# EAGLE design NokiaPic (EAGLE 5.06)
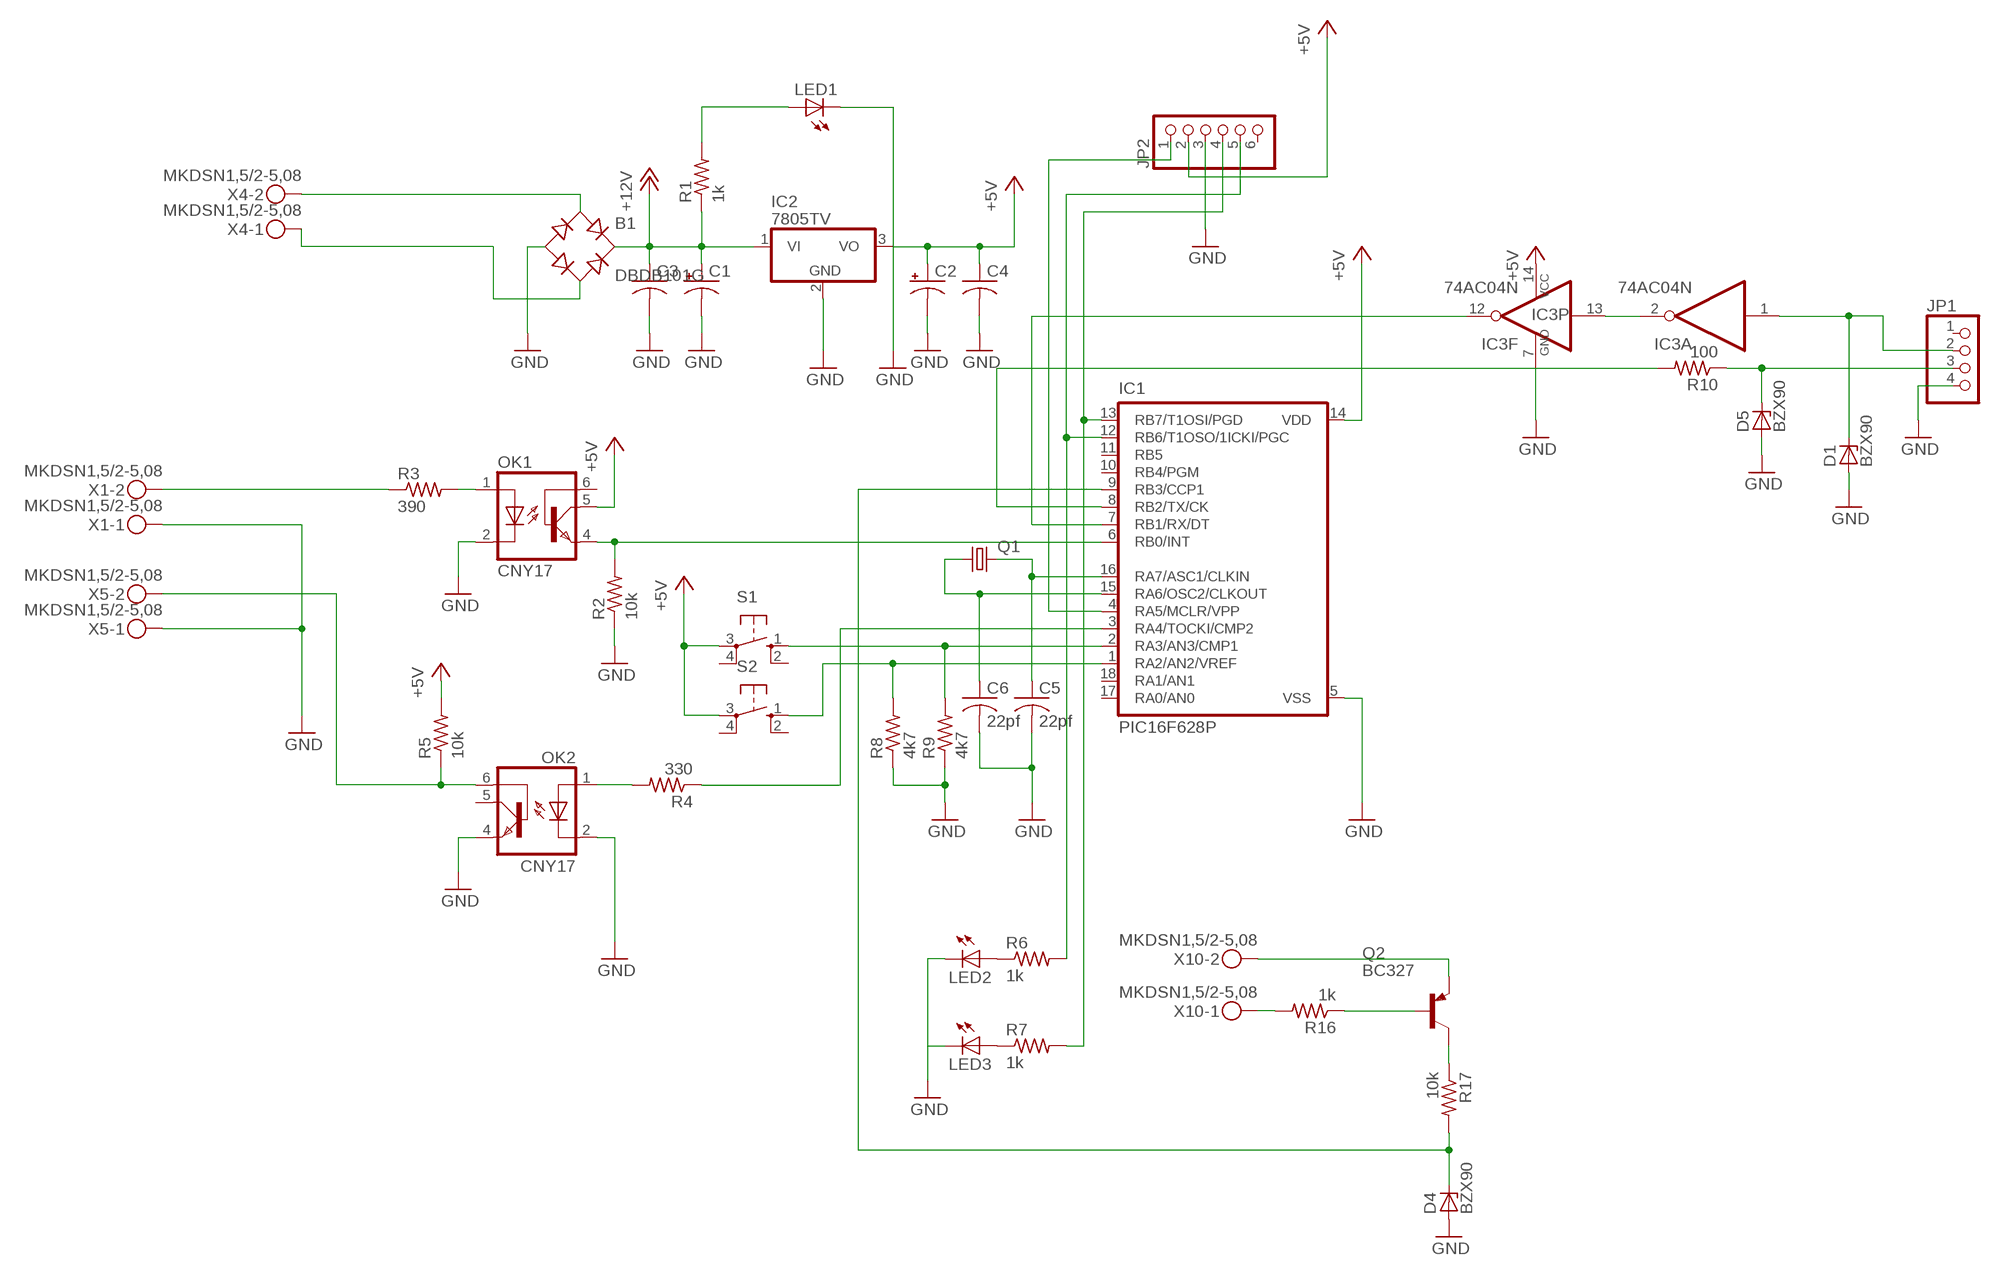
[diagram p0: schematic, sheet 1]

## Parts
B1  DBDB101G  [DB]
C1  CPOL-USE5-8.5  [E5-8,5]
C2  CPOL-USE5-4  [E5-4]
C3  C-US025-025X050  [C025-025X050]
C4  C-US025-025X050  [C025-025X050]
C5  22pf  C-USC1206K  [C1206K]
C6  22pf  C-USC1206K  [C1206K]
D1  BZX90  [DO34Z7]
D4  BZX90  [DO34Z7]
D5  BZX90  [DO34Z7]
IC1  PIC16F628P  [DIL18]
IC2  7805TV  [TO220V]
IC3  74AC04N  [DIL14]
JP1  PINHD-1X4  [1X04]
JP2  PINHD-1X6  [1X06]
LED1  LED3MM  [LED3MM]
LED2  LED3MM  [LED3MM]
LED3  LED3MM  [LED3MM]
OK1  CNY17  [DIL06]
OK2  CNY17  [DIL06]
Q1  CRYSTALHC49S  [HC49/S]
Q2  BC327  [TO92-EBC]
R1  1k  R-US_M1206  [M1206]
R2  10k  R-US_M1206  [M1206]
R3  390  R-US_M1206  [M1206]
R4  330  R-US_M1206  [M1206]
R5  10k  R-US_M1206  [M1206]
R6  1k  R-US_M1206  [M1206]
R7  1k  R-US_M1206  [M1206]
R8  4k7  R-US_M1206  [M1206]
R9  4k7  R-US_M1206  [M1206]
R10  100  R-US_M1206  [M1206]
R16  1k  R-US_M1206  [M1206]
R17  10k  R-US_M1206  [M1206]
S1  10-XX  [B3F-10XX]
S2  10-XX  [B3F-10XX]
X1  MKDSN1,5/2-5,08  [MKDSN1,5/2-5,08]
X4  MKDSN1,5/2-5,08  [MKDSN1,5/2-5,08]
X5  MKDSN1,5/2-5,08  [MKDSN1,5/2-5,08]
X10  MKDSN1,5/2-5,08  [MKDSN1,5/2-5,08]

## Nets
+5V: C2.+ C4.1 IC1.14(VDD) IC2.3(VO) IC3.14(P:VCC) JP2.2 OK1.5(COL) R5.2 S1.3(P) S2.3(P)
+12V: B1.+ C1.+ C3.1 IC2.1(VI) R1.1
GND: B1.- C1.- C2.- C3.2 C4.2 C5.2 C6.2 D1.A D4.A D5.A IC1.5(VSS) IC2.2(GND) IC3.7(P:GND) JP1.4 JP2.3 LED1.K(C) LED2.K(C) LED3.K(C) OK1.2(C) OK2.2(C) OK2.4(EMI) R2.1 R8.1 R9.1 X1.1 X5.1
N$1: OK2.1(A) R4.2
N$2: B1.AC2 X4.1
N$3: B1.AC1 X4.2
N$4: IC1.3(RA4/TOCKI/CMP2) R4.1
N$5: IC1.4(RA5/MCLR/VPP) JP2.1
N$6: LED3.A R7.1
N$7: LED1.A R1.2
N$8: OK1.1(A) R3.2
N$9: IC1.13(RB7/T1OSI/PGD) JP2.4 R7.2
N$10: IC1.6(RB0/INT) OK1.4(EMI) R2.2
N$11: IC1.12(RB6/T1OSO/1ICKI/PGC) JP2.5 R6.2
N$14: OK2.6(BAS) R5.1 X5.2
N$15: R3.1 X1.2
N$16: LED2.A R6.1
N$17: IC3.2(A:O) IC3.13(F:I)
N$18: D1.C IC3.1(A:I) JP1.2
N$19: C5.1 IC1.16(RA7/ASC1/CLKIN) Q1.2
N$20: IC1.1(RA2/AN2/VREF) R8.2 S2.1(S)
N$21: IC1.2(RA3/AN3/CMP1) R9.2 S1.1(S)
N$22: C6.1 IC1.15(RA6/OSC2/CLKOUT) Q1.1
N$23: IC1.8(RB2/TX/CK) R10.2
N$24: D5.C JP1.3 R10.1
N$25: IC1.7(RB1/RX/DT) IC3.12(F:O)
N$44: Q2.E X10.2
N$45: Q2.B R16.1
N$46: Q2.C R17.1
N$47: R16.2 X10.1
N$48: D4.C IC1.9(RB3/CCP1) R17.2
Unconnected: IC1.10(RB4/PGM) IC1.11(RB5) IC1.17(RA0/AN0) IC1.18(RA1/AN1) IC3.3(B:I) IC3.4(B:O) IC3.5(C:I) IC3.6(C:O) IC3.8(D:O) IC3.9(D:I) IC3.10(E:O) IC3.11(E:I) JP1.1 JP2.6 OK1.6(BAS) OK2.5(COL) S1.2(S1) S1.4(P1) S2.2(S1) S2.4(P1)

## Library data of the parts
B1 = rectifier:DB?*G: Single Phase 1.0 AMP Glass Passivated Bridge Rectifier Taiwan Semiconductor Co.,Ltd. - TSC Source: http://www.taiwansemi.com/TSCbig5/ezcatfiles/cust/img/img/db101g.pdf http://www.ts.com.tw/db/pictures/modules/PDT/PDT060207001/DBLS201G.pdf
C1 C2 = rcl:CPOL-US: POLARIZED CAPACITOR, American symbol
C3-C6 = rcl:C-US: CAPACITOR, American symbol
D1 D4 D5 = diode:BZX90: Z DIODE
IC1 = microchip:PIC16*F62: FLASH-Based 8-Bit CMOS Microcontroller Source: http://ww1.microchip.com/downloads/en/DeviceDoc/40300C.pdf
IC2 = linear:78*: Positive VOLTAGE REGULATOR Source: http://cache.national.com/ds/LM/LM78L05.pdf http://www.fairchildsemi.com/ds/LM/LM7805.pdf
IC3 = 74xx-eu:74*04: Hex INVERTER
JP1 = pinhead:PINHD-1X4: PIN HEADER
JP2 = pinhead:PINHD-1X6: PIN HEADER
LED1-LED3 = led:LED: LED OSRAM: - CHIPLED LG R971, LG N971, LY N971, LG Q971, LY Q971, LO R971, LY R971 LH N974, LH R974 LS Q976, LO Q976, LY Q976 LO Q996 - Hyper CHIPLED LW Q18S LB Q993, LB Q99A, LB R99A - SideLED LS A670, LO A670, LY A670, LG A670, LP A670 LB A673, LV A673, LT A673, LW A673 LH A674 LY A675 LS A676, LA A676, LO A676, LY A676, LW A676 LS A679, LY A679, LG A679 - Hyper Micro SIDELED® LS Y876, LA Y876, LO Y876, LY Y876 LT Y87S - SmartLED LW L88C, LW L88S LB L89C, LB L89S, LG L890 LS L89K, LO L89K, LY L89K LS L896, LA L896, LO L896, LY L896 - TOPLED LS T670, LO T670, LY T670, LG T670, LP T670 LSG T670, LSP T670, LSY T670, LOP T670, LYG T670 LG T671, LOG T671, LSG T671 LB T673, LV T673, LT T673, LW T673 LH T674 LS T676, LA T676, LO T676, LY T676, LB T676, LH T676, LSB T676, LW T676 LB T67C, LV T67C, LT T67C, LS T67K, LO T67K, LY T67K, LW E67C LS E67B, LA E67B, LO E67B, LY E67B, LB E67C, LV E67C, LT E67C LW T67C LS T679, LY T679, LG T679 LS T770, LO T770, LY T770, LG T770, LP T770 LB T773, LV T773, LT T773, LW T773 LH T774 LS E675, LA E675, LY E675, LS T675 LS T776, LA T776, LO T776, LY T776, LB T776 LHGB T686 LT T68C, LB T68C - Hyper Mini TOPLED® LB M676 - Mini TOPLED Santana® LG M470 LS M47K, LO M47K, LY M47K Source: http://www.osram.convergy.de LUXEON: - LUMILED® LXK2-PW12-R00, LXK2-PW12-S00, LXK2-PW14-U00, LXK2-PW14-V00 LXK2-PM12-R00, LXK2-PM12-S00, LXK2-PM14-U00 LXK2-PE12-Q00, LXK2-PE12-R00, LXK2-PE12-S00, LXK2-PE14-T00, LXK2-PE14-U00 LXK2-PB12-K00, LXK2-PB12-L00, LXK2-PB12-M00, LXK2-PB14-N00, LXK2-PB14-P00, LXK2-PB14-Q00 LXK2-PR12-L00, LXK2-PR12-M00, LXK2-PR14-Q00, LXK2-PR14-R00 LXK2-PD12-Q00, LXK2-PD12-R00, LXK2-PD12-S00 LXK2-PH12-R00, LXK2-PH12-S00 LXK2-PL12-P00, LXK2-PL12-Q00, LXK2-PL12-R00 Source: www.luxeon.com KINGBRIGHT: KA-3528ASYC Source: www.kingbright.com
OK1 OK2 = optocoupler:CNY17: SIEMENS OPTO COUPLER
Q1 = crystal:CRYSTAL: CRYSTAL
Q2 = transistor-pnp:BC327*: PNP Transistror
R1-R10 R16 R17 = rcl:R-US_: RESISTOR, American symbol
S1 S2 = switch-omron:10-XX: OMRON SWITCH
X1 X4 X5 X10 = con-phoenix-508:MKDSN1,5/2-5,08: MKDSN 1,5/ 2-5,08 Printklemme Nennstrom: 13,5 A Nennspannung: 250 V Rastermaß: 5,08 mm Polzahl: 2 Anschlussart: Schraubanschluss Montage: Löten Anschlussrichtung Leiter/Platine: 0 ° Artikelnummer: 1729128 Source: http://eshop.phoenixcontact.com .. 1729128.pdf

## Board
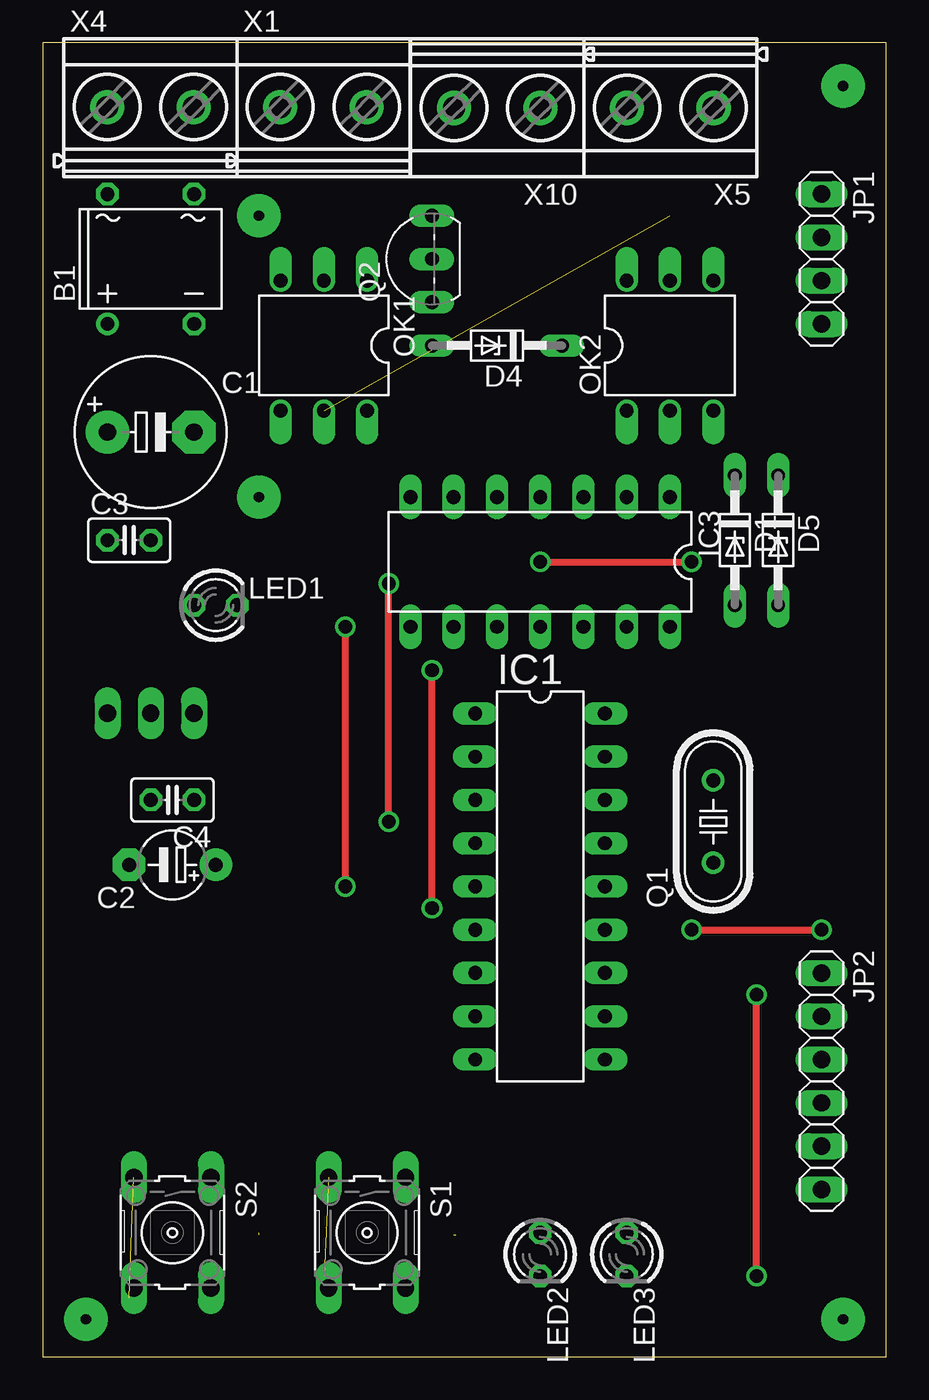
[diagram p1: board, top side]
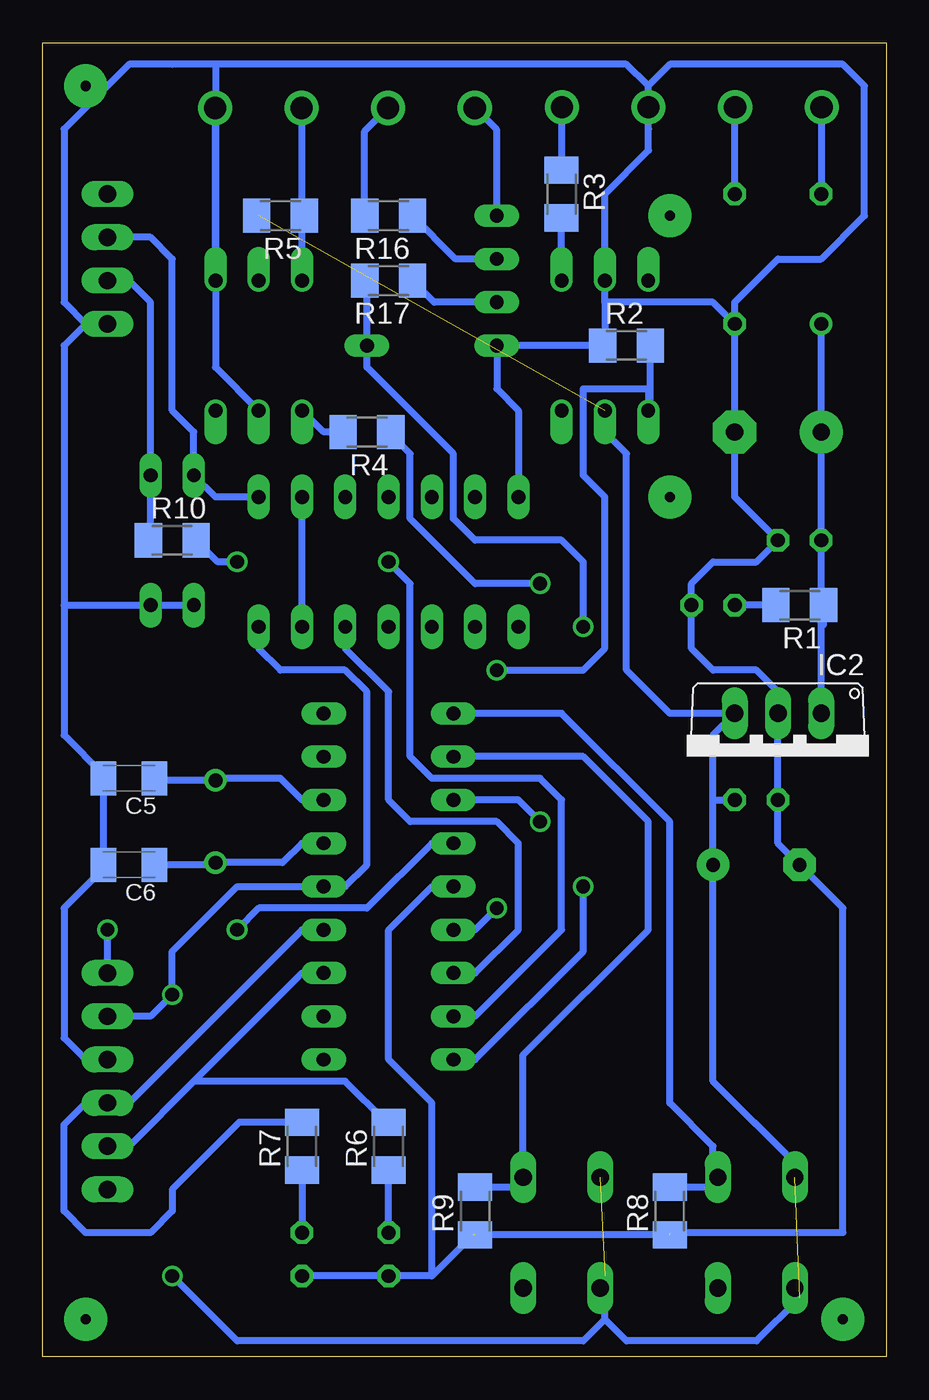
[diagram p2: board, bottom side, seen from below]

Size 49.52 x 77.14 mm. Coordinates in mm from the lower left corner, seen from the top.
Outline: 0,77.14 0,0 49.52,0 49.52,77.14 0,77.14
Copper layers (1*16): Top 0.035mm / dielectric 1.5mm / Bottom 0.035mm
Design rules "default": minimum track width 10mil, minimum drill 24mil, track to track 8mil, track to pad 8mil, pad to pad 8mil, via to via 8mil, smd to smd 8mil, copper to edge 40mil, drill to drill 8mil, minimum pad ring 10mil, minimum via ring 8mil, stop-mask expansion 4mil, vias tented up to drill 0mil, thermal gap 10mil

### Footprints (pad centres in the part's own frame; a part is rotated, then mirrored left to right if it is on the bottom)
DB = drill 0.813 round: + -2.54,-3.81 | drill 0.813 octagon: - 2.54,-3.81; AC1 2.54,3.81; AC2 -2.54,3.81
E5-8,5 = drill 1.016 pad 2.54 round: + -2.54,0 | drill 1.016 pad 2.54 octagon: - 2.54,0
E5-4 = drill 0.813 pad 1.905 round: + -2.54,0 | drill 0.813 pad 1.905 octagon: - 2.54,0
C025-025X050 = drill 0.813 octagon: 1 -1.27,0; 2 1.27,0
C1206K = smd 1.5 x 2: 1 -1.5,0; 2 1.5,0
DO34Z7 = drill 0.813 long: A 3.81,0; C -3.81,0
DIL18 = drill 0.813 long: 1 -10.16,-3.81; 2 -7.62,-3.81; 3 -5.08,-3.81; 4 -2.54,-3.81; 5 0,-3.81; 6 2.54,-3.81; 7 5.08,-3.81; 8 7.62,-3.81; 9 10.16,-3.81; 10 10.16,3.81; 11 7.62,3.81; 12 5.08,3.81; 13 2.54,3.81; 14 0,3.81; 15 -2.54,3.81; 16 -5.08,3.81; 17 -7.62,3.81; 18 -10.16,3.81
TO220V = drill 1.016 long: 1 -2.54,-2.54; 2 0,-2.54; 3 2.54,-2.54
DIL14 = drill 0.813 long: 1 -7.62,-3.81; 2 -5.08,-3.81; 3 -2.54,-3.81; 4 0,-3.81; 5 2.54,-3.81; 6 5.08,-3.81; 7 7.62,-3.81; 8 7.62,3.81; 9 5.08,3.81; 10 2.54,3.81; 11 0,3.81; 12 -2.54,3.81; 13 -5.08,3.81; 14 -7.62,3.81
1X04 = drill 1.016 long: 1 -3.81,0; 2 -1.27,0; 3 1.27,0; 4 3.81,0
1X06 = drill 1.016 long: 1 -6.35,0; 2 -3.81,0; 3 -1.27,0; 4 1.27,0; 5 3.81,0; 6 6.35,0
LED3MM = drill 0.813 octagon: A -1.27,0; K 1.27,0
DIL06 = drill 0.813 offset: 1 -2.54,-3.81; 2 0,-3.81; 3 2.54,-3.81; 4 2.54,3.81; 5 0,3.81; 6 -2.54,3.81
HC49/S = drill 0.813 round: 1 -2.413,0; 2 2.413,0
TO92-EBC = drill 0.813 long: B 0,-1.27; C -2.54,-1.27; E 2.54,-1.27
M1206 = smd 1.6 x 2: 1 -1.4,0; 2 1.4,0
B3F-10XX = drill 1.016 long: 1 -3.251,2.261; 2 3.251,2.261; 3 -3.251,-2.261; 4 3.251,-2.261
MKDSN1,5/2-5,08 = drill 1.3 pad 2 round: 1 -2.561,0.025; 2 2.519,0.025

### Placement (x,y rotation side)
B1  6.35,64.44 0 top
C1  6.35,54.28 0 top
C2  7.62,28.88 180 top
C3  5.08,47.93 0 top
C4  7.62,32.69 180 top
C5  44.45,33.96 180 bottom
C6  44.45,28.88 180 bottom
D1  40.64,47.93 270 top
D4  26.67,59.36 180 top
D5  43.18,47.93 270 top
IC1  29.21,27.61 270 top
IC2  6.35,35.23 180 bottom
IC3  29.21,46.66 180 top
JP1  45.72,64.44 270 top
JP2  45.72,16.18 270 top
LED1  10.16,44.12 0 top
LED2  29.21,6.02 270 top
LED3  34.29,6.02 270 top
OK1  16.51,59.36 180 top
OK2  36.83,59.36 0 top
Q1  39.37,31.42 90 top
Q2  21.59,64.44 90 top
R1  5.08,44.12 180 bottom
R2  15.24,59.36 0 bottom
R3  19.05,68.25 270 bottom
R4  30.48,54.28 180 bottom
R5  35.56,66.98 180 bottom
R6  29.21,12.37 90 bottom
R7  34.29,12.37 90 bottom
R8  12.7,8.56 90 bottom
R9  24.13,8.56 90 bottom
R10  41.91,47.93 0 bottom
R16  29.21,66.98 180 bottom
R17  29.21,63.17 180 bottom
S1  19.05,7.29 270 top
S2  7.62,7.29 270 top
X1  16.51,73.33 0 top
X4  6.35,73.33 0 top
X5  36.83,73.33 180 top
X10  26.67,73.33 180 top

### Tracks (layer width: path | path; a pad name or v marks a point on that pad's centre or on a via)
+5V  (via drill 0.8)  (3 unrouted)
  Top 0.406: v41.91,4.75 v41.91,21.26
  Bottom 0.406: 10.16,32.69 C4.1 | 10.16,32.69 C2.+ 10.16,16.18 | OK1.5 16.51,54.28 15.24,53.01 15.24,40.31 12.7,37.77 IC2.3 10.16,36.5 10.16,32.69 | IC3.14 36.83,41.58 35.56,40.31 31.75,40.31 30.48,39.04 30.48,28.88 31.75,27.61 IC1.14 38.1,27.61 41.91,23.8 v41.91,21.26 43.18,19.99 JP2.2 | R5.2 36.83,66.98 | S2.3 5.36,11.38 10.16,16.18 | 10.16,16.18 5.08,11.1 | 5.08,3.48 7.62,0.94 15.24,0.94 16.51,2.21 | 16.51,2.21 16.51,4.75 | 16.51,2.21 17.78,0.94 38.1,0.94 v41.91,4.75
+12V
  Bottom 0.406: B1.+ C1.+ C3.1 3.81,44.25 R1.1 | 3.68,43.52 3.81,44.66 | R1.1 3.68,43.52 | 3.68,43.52 3.68,42.98 | IC2.1 3.81,44.12 R1.1
GND  (2 unrouted)
  Bottom 0.406: 13.95,70.81 13.95,72.06 | 13.95,72.06 X1.1 | 13.95,70.81 16.51,68.25 OK1.2 16.51,61.9 | B1.- C1.- 8.89,50.47 C3.2 6.35,47.89 6.39,47.89 7.62,46.66 10.16,46.66 11.43,45.39 LED1.K 11.43,41.58 10.16,40.31 7.62,40.31 6.35,39.04 IC2.2 C4.2 6.35,30.15 C2.- 2.54,26.34 2.54,7.29 12.7,7.29 | JP2.3 46.99,17.45 48.26,18.72 48.26,26.34 45.95,28.65 C6.2 C5.2 45.95,34.19 48.26,36.5 48.26,44.12 | 39.37,75.87 15.24,75.87 13.97,74.6 13.97,72.08 13.95,72.06 | 39.37,75.87 41.91,75.87 | 13.95,70.81 13.95,74.62 12.7,75.87 2.54,75.87 1.27,74.6 1.27,66.98 3.81,64.44 6.35,64.44 8.89,61.9 B1.- | 16.51,61.9 16.51,59.49 R2.1 D4.A 22.86,56.82 21.59,55.55 IC3.7 | 16.51,61.9 10.16,61.9 B1.- | IC1.5 26.67,27.61 29.21,25.07 29.21,17.45 26.67,14.91 26.67,4.75 | OK2.4 39.37,73.28 X5.1 | 39.37,75.87 OK2.4 | 39.37,75.87 44.45,75.87 48.26,72.06 48.26,61.9 46.99,60.63 | 46.99,60.63 JP1.4 | 46.99,60.63 48.26,59.36 48.26,44.12 | D1.A D5.A 48.26,44.12 | OK2.4 39.37,58.09 OK2.2 | LED3.K LED2.K 26.67,4.75 | R8.1 24.26,7.16 26.67,4.75
N$1
  Bottom 0.406: 34.16,55.68 OK2.1 33.02,54.28 R4.2
N$2
  Bottom 0.406: X4.1 3.79,68.27 B1.AC2
N$3
  Bottom 0.406: X4.2 8.87,68.27 B1.AC1
N$4  (via drill 0.8)
  Top 0.406: v20.32,31.42 v20.32,45.39
  Bottom 0.406: R4.1 29.08,54.15 27.94,53.01 27.94,49.2 24.13,45.39 v20.32,45.39 | v20.32,31.42 21.59,32.69 IC1.3
N$5  (via drill 0.8)
  Top 0.406: v38.1,25.07 v45.72,25.07
  Bottom 0.406: IC1.4 26.67,30.15 30.48,26.34 36.83,26.34 v38.1,25.07 | v45.72,25.07 JP2.1
N$6
  Bottom 0.406: R7.1 LED3.A
N$7
  Bottom 0.406: R1.2 LED1.A
N$8
  Bottom 0.406: OK1.1 R3.2
N$9
  Bottom 0.406: IC1.13 34.29,25.07 44.45,14.91 JP2.4 46.99,14.91 48.26,13.64 48.26,8.56 46.99,7.29 43.18,7.29 41.91,8.56 41.91,9.83 37.97,13.77 R7.2
N$10  (via drill 0.8 pad 1.02)
  Top 0.406: v22.86,26.34 v22.86,40.31
  Bottom 0.406: R2.2 13.84,55.68 OK1.4 13.97,56.82 17.78,56.82 17.78,51.74 16.51,50.47 16.51,41.58 17.78,40.31 v22.86,40.31 | v22.86,26.34 24.13,25.07 IC1.6
N$11
  Bottom 0.406: IC1.12 34.29,22.53 40.64,16.18 | 40.64,16.18 44.45,12.37 JP2.5 | R6.2 29.34,13.77 31.75,16.18 40.64,16.18
N$12  (via drill 0.6 pad 2.54)
  other vias: 2.54,2.21
N$13  (via drill 0.6 pad 2.54)
  other vias: 46.99,2.21
N$14
  Bottom 0.406: R5.1 34.29,66.85 OK2.6 34.29,73.28 X5.2
N$15
  Bottom 0.406: X1.2 19.03,69.67 R3.1
N$16
  Bottom 0.406: LED2.A R6.1
N$17
  Bottom 0.406: IC3.13 IC3.2
N$18
  Bottom 0.406: JP1.2 43.18,65.71 41.91,64.44 41.91,55.55 40.64,54.28 D1.C 39.37,50.47 IC3.1
N$19
  Bottom 0.406: IC1.16 34.29,32.69 35.56,33.96 39.24,33.96 Q1.2 42.82,33.83 C5.1
N$20
  Bottom 0.406: IC1.1 19.05,37.77 12.7,31.42 12.7,14.91 10.16,12.37 10.16,10.82 S2.1 10.16,10.26 10.16,9.83 10.29,9.96 R8.2
N$21
  Bottom 0.406: IC1.2 17.78,35.23 13.97,31.42 13.97,25.07 21.31,17.73 S1.1 21.89,9.96 R9.2
N$22
  Bottom 0.406: C6.1 39.5,28.88 Q1.1 35.43,29.01 34.29,30.15 IC1.15
N$23  (via drill 0.8)
  Top 0.406: v29.21,46.66 v38.1,46.66
  Bottom 0.406: IC1.8 24.13,19.99 19.05,25.07 19.05,32.69 20.32,33.96 26.67,33.96 27.94,35.23 27.94,45.39 v29.21,46.66 | v38.1,46.66 39.24,46.66 R10.2
N$24
  Bottom 0.406: JP1.3 44.45,63.17 43.18,61.9 D5.C 43.18,48.06 R10.1
N$25
  Bottom 0.406: IC1.7 24.13,22.53 21.59,25.07 21.59,30.15 22.86,31.42 27.94,31.42 29.21,32.69 29.21,39.04 31.75,41.58 IC3.12
N$26  (via drill 0.6 pad 2.54)
  other vias: 46.99,74.6
N$27  (via drill 0.6 pad 2.54)
  other vias: 12.7,66.98
N$28  (via drill 0.6 pad 2.54)
  other vias: 12.7,50.47
N$44
  Bottom 0.406: Q2.E 22.86,72.01 X10.2
N$45
  Bottom 0.406: R16.1 25.27,64.44 Q2.B
N$46
  Bottom 0.406: Q2.C 26.54,61.9 R17.1
N$47
  Bottom 0.406: X10.1 30.61,71.93 R16.2
N$48  (via drill 0.8 pad 1.02)
  Top 0.406: v17.78,27.61 v17.78,42.85
  Bottom 0.406: R17.2 30.48,63.04 D4.C 30.48,58.09 25.4,53.01 25.4,49.2 24.13,47.93 19.05,47.93 17.78,46.66 v17.78,42.85 | IC1.9 24.13,17.45 17.78,23.8 v17.78,27.61